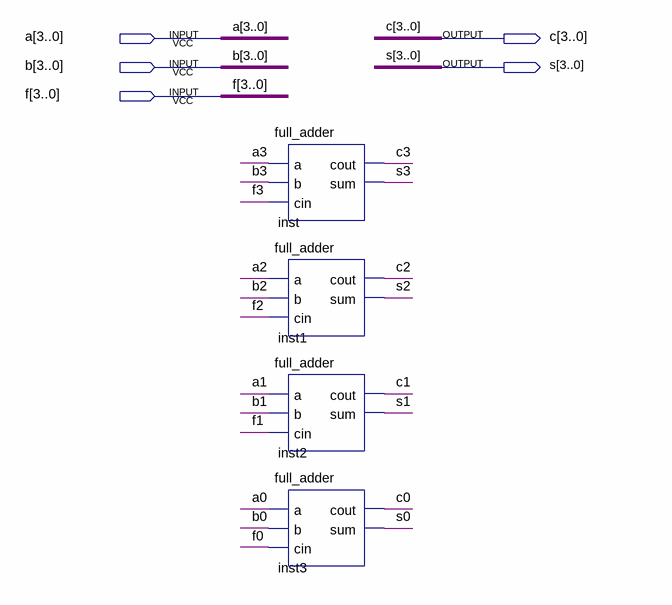
[diagram p0: schematic sheet]
// Quartus schematic carrysaveadder.bdf as structural Verilog: 4 symbols, 5 pins
module carrysaveadder (
  input  [3:0] a,
  input  [3:0] b,
  input  [3:0] f,
  output [3:0] c,
  output [3:0] s
);

  full_adder inst (.a(a[3]), .b(b[3]), .cin(f[3]), .cout(c[3]), .sum(s[3]));
  full_adder inst1 (.a(a[2]), .b(b[2]), .cin(f[2]), .cout(c[2]), .sum(s[2]));
  full_adder inst2 (.a(a[1]), .b(b[1]), .cin(f[1]), .cout(c[1]), .sum(s[1]));
  full_adder inst3 (.a(a[0]), .b(b[0]), .cin(f[0]), .cout(c[0]), .sum(s[0]));
endmodule
